# Altium schematic sheet 05I2S.SchDoc
size A4
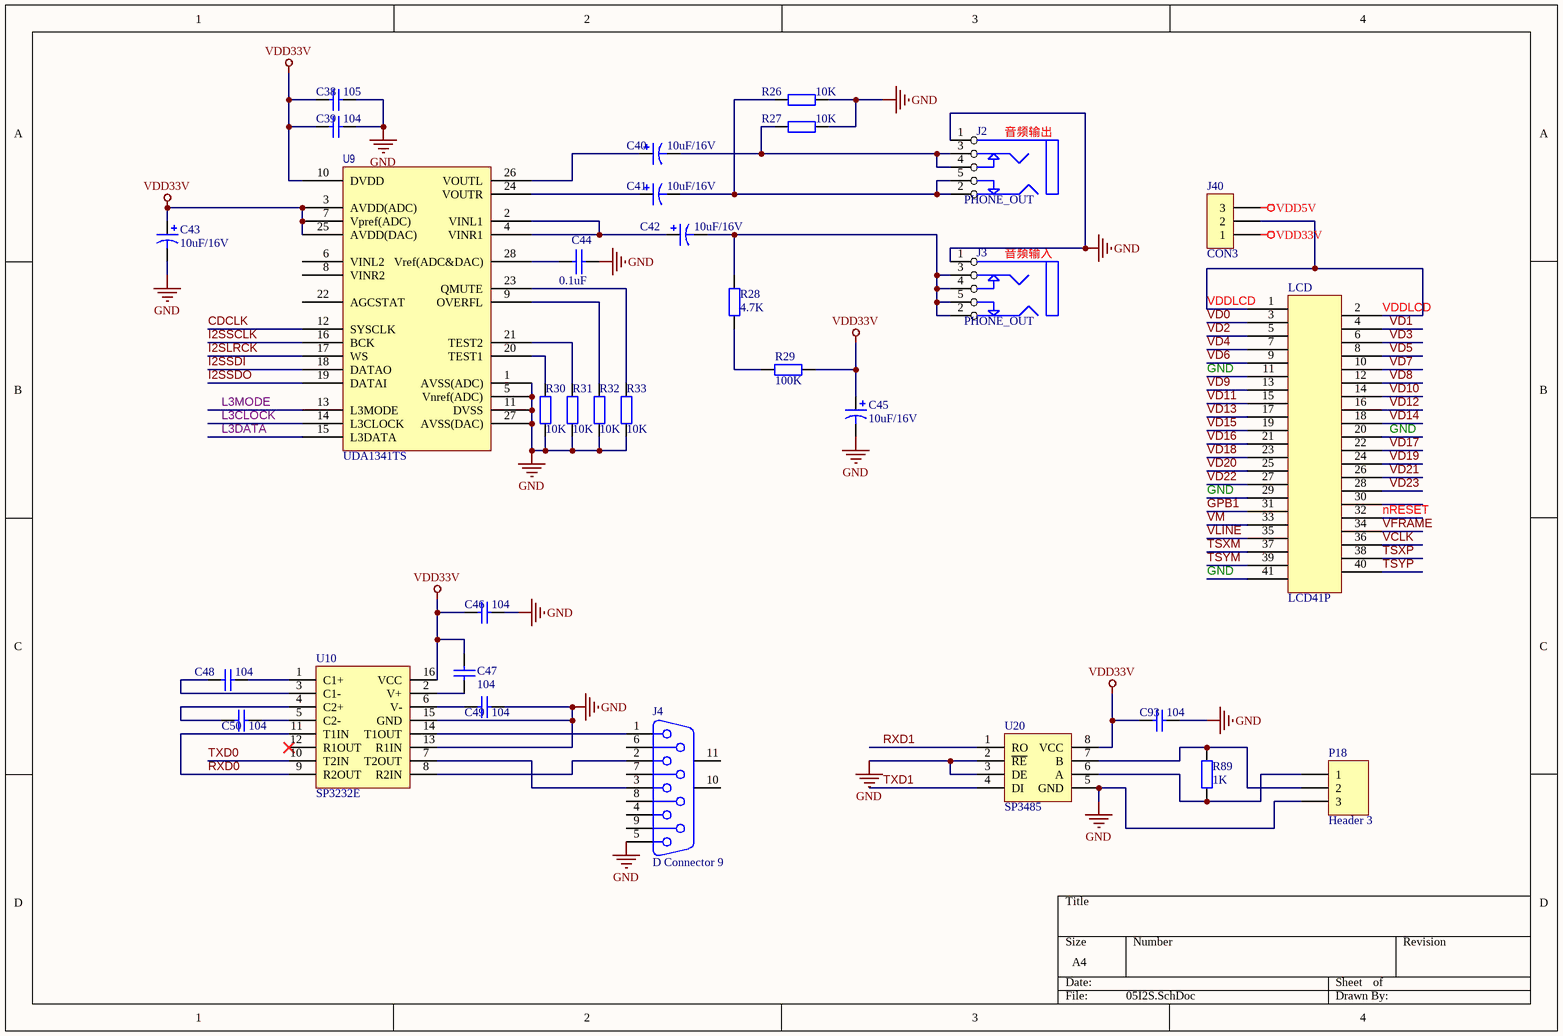
[diagram p0: 05I2S.SchDoc]

## Parts
C38  value 105  [0603A]  (hidden comment: Cap)
C39  value 104  [0603A]  (hidden comment: Cap)
C40  value 10uF/16V  [1206[3216]]  (hidden comment: Cap Pol2)
C41  value 10uF/16V  [1206[3216]]  (hidden comment: Cap Pol2)
C42  value 10uF/16V  [1206[3216]]  (hidden comment: Cap Pol2)
C43  value 10uF/16V  [1206[3216]]  (hidden comment: Cap Pol2)
C44  0.1uF  [0603A]
C45  value 10uF/16V  [1206[3216]]  (hidden comment: Cap Pol2)
C46  value 104  [0603A]  (hidden comment: Cap)
C47  value 104  [0603A]  (hidden comment: Cap)
C48  value 104  [0603A]  (hidden comment: Cap)
C49  value 104  [0603A]  (hidden comment: Cap)
C50  value 104  [0603A]  (hidden comment: Cap)
C93  value 104  [0603A]  (hidden comment: Cap)
J2  PHONE_OUT  [ST-3150-5N]
J3  PHONE_OUT  [ST-3150-5N]
J4  D Connector 9  [DSUB1.385-2H9]
J40  CON3  [HDR1X3]
LCD  LCD41P  [FPC40]
P18  Header 3  [HDR1X3]
R26  value 10K  [0603R]  (hidden comment: Res2)
R27  value 10K  [0603R]  (hidden comment: Res2)
R28  value 4.7K  [0603R]  (hidden comment: Res2)
R29  value 100K  [0603R]  (hidden comment: Res2)
R30  value 10K  [0603R]  (hidden comment: Res2)
R31  value 10K  [0603R]  (hidden comment: Res2)
R32  value 10K  [0603R]  (hidden comment: Res2)
R33  value 10K  [0603R]  (hidden comment: Res2)
R89  value 1K  [0603R]  (hidden comment: Res2)
U9  UDA1341TS  [SOP28]
U10  SP3232E  [SOP16_SP3232]
U20  SP3485  [PCBComponent_1]

## Nets
GND: C38.1 C39.1 C43.2 C44.2 C45.2 C46.2 C49.2 C93.2 J2.1(A) J3.1(A) J4.5 LCD.11 LCD.20 LCD.29 LCD.41 P18.3 R26.2 R27.2 R30.1 R31.1 R32.1 R33.1 U9.1(AVSS(ADC)) U9.5(Vnref(ADC)) U9.11(DVSS) U9.27(AVSS(DAC)) U10.13(R1IN) U10.15(GND) U20.2(~{RE}) U20.3(DE) U20.5(GND)
VDD5V: J40.3
VDD33V: C38.2 C39.2 C43.1 C45.1 C46.1 C47.2 C93.1 J40.1 R29.1 U9.3(AVDD(ADC)) U9.7(Vpref(ADC)) U9.10(DVDD) U9.25(AVDD(DAC)) U10.16(VCC) U20.8(VCC)
CDCLK: U9.12(SYSCLK)
GPB1: LCD.31
I2SLRCK: U9.17(WS)
I2SSCLK: U9.16(BCK)
I2SSDI: U9.18(DATAO)
I2SSDO: U9.19(DATAI)
L3CLOCK: U9.14(L3CLOCK)
L3DATA: U9.15(L3DATA)
L3MODE: U9.13(L3MODE)
nRESET: LCD.32
RXD0: U10.9(R2OUT) U10.11(T1IN)
RXD1: U20.1(RO)
TSXM: LCD.37
TSXP: LCD.38
TSYM: LCD.39
TSYP: LCD.40
TXD0: U10.10(T2IN)
TXD1: U20.4(DI)
VCLK: LCD.36
VD0: LCD.3
VD1: LCD.4
VD2: LCD.5
VD3: LCD.6
VD4: LCD.7
VD5: LCD.8
VD6: LCD.9
VD7: LCD.10
VD8: LCD.12
VD9: LCD.13
VD10: LCD.14
VD11: LCD.15
VD12: LCD.16
VD13: LCD.17
VD14: LCD.18
VD15: LCD.19
VD16: LCD.21
VD17: LCD.22
VD18: LCD.23
VD19: LCD.24
VD20: LCD.25
VD21: LCD.26
VD22: LCD.27
VD23: LCD.28
VDDLCD: J40.2 LCD.1 LCD.2
VFRAME: LCD.34
VLINE: LCD.35
VM: LCD.33
NetC40_1: C40.1 U9.26(VOUTL)
NetC40_2: C40.2 J2.3(C) J2.4(E) R27.1
NetC41_1: C41.1 U9.24(VOUTR)
NetC41_2: C41.2 J2.2(B) J2.5(F) R26.1
NetC42_1: C42.1 U9.2(VINL1) U9.4(VINR1)
NetC42_2: C42.2 J3.2(B) J3.3(C) J3.4(E) J3.5(F) R28.2
NetC44_1: C44.1 U9.28(Vref(ADC&DAC))
NetC47_1: C47.1 U10.2(V+)
NetC48_1: C48.1 U10.3(C1-)
NetC48_2: C48.2 U10.1(C1+)
NetC49_1: C49.1 U10.6(V-)
NetC50_1: C50.1 U10.4(C2+)
NetC50_2: C50.2 U10.5(C2-)
NetJ4_1: J4.1 U10.14(T1OUT)
NetJ4_2: J4.2 U10.8(R2IN)
NetJ4_3: J4.3 U10.7(T2OUT)
NetP18_1: P18.1 R89.1 U20.6(A)
NetP18_2: P18.2 R89.2 U20.7(B)
NetR28_1: R28.1 R29.2
NetR30_2: R30.2 U9.20(TEST1)
NetR31_2: R31.2 U9.21(TEST2)
NetR32_2: R32.2 U9.9(OVERFL)
NetR33_2: R33.2 U9.23(QMUTE)

Not connected (* = marked no-connect by the designer): J4 4 6 7 8 9 10(MH1) 11(MH2); LCD 30; U9 6(VINL2) 8(VINR2) 22(AGCSTAT); U10 12(R1OUT)*

## Notes on the sheet
- (near J2) 音频输出
- (near J3) 音频输入

## Library data of the parts
C38 C39 C46-C50 C93 = Cap: Capacitor; Published: 8-Jun-2000; LatestRevisionDate: 17-Jul-2002; LatestRevisionNote: Re-released for DXP Platform.; PackageReference: RAD-0.3; Publisher: Altium Limited
C40-C43 C45 = Cap Pol2: Polarized Capacitor (Axial); Published: 8-Jun-2000; LatestRevisionDate: 17-Jul-2002; LatestRevisionNote: Re-released for DXP Platform.; PackageReference: POLAR0.8; Publisher: Altium Limited
C44 = CAP: Capacitor; Value: 0.1uF
J2 J3 = PHONEJACK STEREO SW: Value: PHONE_OUT
J4 = D Connector 9: Receptacle Assembly, 9 Position, Right Angle; PackageDocument: O; Positions: 9; Published: 15-Jun-2001; LatestRevisionDate: 17-Jul-2002; LatestRevisionNote: Re-released for DXP Platform.; DatasheetDocument: 1-Sep-1999; PackageReference: 788750; Publisher: Altium Limited; Orientation: Right Angle; Gender: Receptacle
J40 = CON3: Connector
P18 = Header 3: Header, 3-Pin; LatestRevisionDate: 17-Jul-2002; LatestRevisionNote: Re-released for DXP Platform.; Publisher: Altium Limited
R26-R33 R89 = Res2: Resistor; Published: 8-Jun-2000; LatestRevisionDate: 17-Jul-2002; LatestRevisionNote: Re-released for DXP Platform.; PackageReference: AXIAL-0.4; Publisher: Altium Limited
U9 = UDA1341TS_1: Text Field1: 160; Text Field2: 170; Value: UDA1341TS
U10 = SP3232E: Value: SP3232E
U20 = SP3485: Value: SP3485